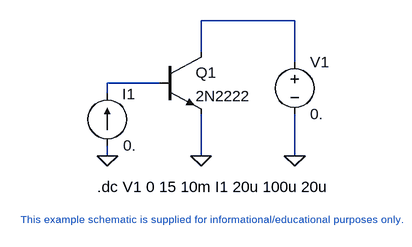
[diagram p0: schematic curvetrace.asc]
curvetrace.asc, the LTspice schematic file:
Version 4.1
SHEET 1 2612 1528
WIRE 2128 1152 1984 1152
WIRE 1984 1200 1984 1152
WIRE 2128 1216 2128 1152
WIRE 1920 1248 1840 1248
WIRE 1840 1264 1840 1248
WIRE 1840 1360 1840 1344
WIRE 1984 1360 1984 1296
WIRE 2128 1360 2128 1296
FLAG 2128 1360 0
FLAG 1984 1360 0
FLAG 1840 1360 0
SYMBOL npn 1920 1200 R0
SYMATTR InstName Q1
SYMATTR Value 2N2222
SYMBOL voltage 2128 1200 R0
SYMATTR InstName V1
SYMATTR Value 0.
SYMBOL current 1840 1344 M180
WINDOW 0 23 79 Left 2
WINDOW 3 24 0 Left 2
SYMATTR InstName I1
SYMATTR Value 0.
TEXT 1824 1408 Left 2 !.dc V1 0 15 10m I1 20u 100u 20u
TEXT 1992 1448 Top 1 ;This example schematic is supplied for informational/educational purposes only.

The netlist it stands for:
* curvetrace.asc
Q1 N001 N002 0 0 2N2222
V1 N001 0 0.
I1 0 N002 0.
.model NPN NPN
.model PNP PNP
.lib standard.bjt
.dc V1 0 15 10m I1 20u 100u 20u
* This example schematic is supplied for informational/educational purposes only.
.backanno
.end